# Altium project BMS_2020.PrjPcb (part 2 of 2)

## Sheet TemperatureSensors.SchDoc: Temperature Sensors
size A4; DrawnBy: Jonn Dillon; DocumentNumber: 9; SheetNumber: 9; SheetTotal: 10; Version: 01; Project: Battery Managment System 2020; PageSetup: Record=PageOptions|CenterHorizontal=True|CenterVertical=True|PrintScale=0.97|XCorrection=1.00|YCorrection=1.00|PrintKind=0|BorderSize=5000000|LeftOffset=0|BottomOffset=0|Orientation=2|PaperLength=1000|PaperWidth=1000|Scale=100|PaperSource=7|PrintQuality=-4|MediaType=1|DitherType=10|PaperKind=A4|PrintScaleMode=1
Used 4 times, as channels Temperature Sensor and Connectors/FlexPCBTempSensors1, Temperature Sensor and Connectors/FlexPCBTempSensors2, Temperature Sensor and Connectors/FlexPCBTempSensors3, Temperature Sensor and Connectors/FlexPCBTempSensors4. Parts and nets are listed once, with the designators drawn on the sheet.
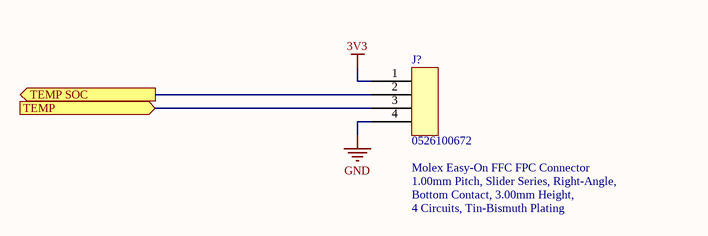
[diagram p8: TemperatureSensors.SchDoc]

### Parts
J?  0526100672  [522710479]

### Ports
TEMP (in), TEMP SOC (out)

### Nets
3V3: J?.1
GND: J?.4
TEMP: J?.3 ; port TEMP
TEMP SOC: J?.2 ; port TEMP SOC

### Channels
Temperature Sensor and Connectors/FlexPCBTempSensors1: designators end in _FlexPCBTempSensors1; ports TEMP SOC=TEMP SOC TEMP=TEMP1
Temperature Sensor and Connectors/FlexPCBTempSensors2: designators end in _FlexPCBTempSensors2; ports TEMP SOC=TEMP SOC TEMP=TEMP2
Temperature Sensor and Connectors/FlexPCBTempSensors3: designators end in _FlexPCBTempSensors3; ports TEMP SOC=TEMP SOC TEMP=TEMP3
Temperature Sensor and Connectors/FlexPCBTempSensors4: designators end in _FlexPCBTempSensors4; ports TEMP SOC=TEMP SOC TEMP=TEMP4

### Notes on the sheet
- (near J?) Molex Easy-On FFC FPC Connector
- 1.00mm Pitch, Slider Series, Right-Angle,
- Bottom Contact, 3.00mm Height,
- 4 Circuits, Tin-Bismuth Plating
- Revision History:
- Sheet Title:
- Rev
- Date
- Description
- Project:
- Size:
- Drawn By:
- A3
- Number:
- Revision:
- Sheet
- Version:
- of
- QUT Motorsport
- O-120, Gardens Point
- 2 George Street
- Brisbane, QLD 4000
- Australia
- Print Date:
- Print Time:
- File Name:

### Library data of the parts
J? = 4PinMOLEX

## Nets that join several sheets
3V3: IsolationBarrier (R?#1.2), CANBUS_3V3_Isolated (C11.1 J4.1 U4.1), MCU (20 pins), PSU_Disconnect (5 pins), TemperatureSensor (P?#3.1), Temperature Sensor and Connectors/FlexPCBTempSensors1 (J?_FlexPCBTempSensors1.1), Temperature Sensor and Connectors/FlexPCBTempSensors2 (J?_FlexPCBTempSensors2.1), Temperature Sensor and Connectors/FlexPCBTempSensors3 (J?_FlexPCBTempSensors3.1), Temperature Sensor and Connectors/FlexPCBTempSensors4 (J?_FlexPCBTempSensors4.1)
36V: CellMonitor (Q?.3 R?#2.1), PSU_Disconnect (C?#9.2 U6.5)
CF0: CANBUS_3V3_Isolated (C11.2 U4.4), MCU (18 pins), CellMonitor (17 pins), Cell Monitor and Front End/CELL 1 INTERFACE (C?_CELL_1_INTERFACE.1), PSU_Disconnect (6 pins), TemperatureSensor (P?#3.4), Temperature Sensor and Connectors/FlexPCBTempSensors1 (J?_FlexPCBTempSensors1.4), Temperature Sensor and Connectors/FlexPCBTempSensors2 (J?_FlexPCBTempSensors2.4), Temperature Sensor and Connectors/FlexPCBTempSensors3 (J?_FlexPCBTempSensors3.4), Temperature Sensor and Connectors/FlexPCBTempSensors4 (J?_FlexPCBTempSensors4.4)
CVF1: CellMonitor (F?#11.2 R?#11.1), Cell Monitor and Front End/CELL 1 INTERFACE (J8_CELL_1_INTERFACE.1 R14_CELL_1_INTERFACE.1), Cell Monitor and Front End/CELL 2 INTERFACE (D?_CELL_2_INTERFACE.1 Q?_CELL_2_INTERFACE.3)
CVF5: CellMonitor (F?#7.2 R?#7.1 R?#10.1), Cell Monitor and Front End/CELL 5 INTERFACE (J8_CELL_5_INTERFACE.1 R14_CELL_5_INTERFACE.1), Cell Monitor and Front End/CELL 6 INTERFACE (D?_CELL_6_INTERFACE.1 Q?_CELL_6_INTERFACE.3)
ISO 3V3: IsolationBarrier (J?#1.5 J?#2.5), CANBUS_3V3_Isolated (5 pins)
ISO GND: IsolationBarrier (5 pins), CANBUS_3V3_Isolated (6 pins)
VC5X: CellMonitor (C?#7.1 D?#3.K R?#6.1), Cell Monitor and Front End/CELL 6 INTERFACE (C?_CELL_6_INTERFACE.1)
BMS BOOT: IsolationBarrier (U3.3), CellMonitor (R?#12.1 S?.1 U?#3.6)
CAN RX: CANBUS_3V3_Isolated (R10.1 TP6.1 U4.3), MCU (U1.32)
CAN TX: CANBUS_3V3_Isolated (R9.1 TP3.1 U4.2), MCU (U1.33)
CVF0: CellMonitor (F?#12.2 R?#13.1 R?#14.1), Cell Monitor and Front End/CELL 1 INTERFACE (D?_CELL_1_INTERFACE.1 Q?_CELL_1_INTERFACE.3)
CVF2: CellMonitor (F?#10.2), Cell Monitor and Front End/CELL 2 INTERFACE (J8_CELL_2_INTERFACE.1 R14_CELL_2_INTERFACE.1)
CVF3: CellMonitor (F?#9.2), Cell Monitor and Front End/CELL 3 INTERFACE (J8_CELL_3_INTERFACE.1 R14_CELL_3_INTERFACE.1), Cell Monitor and Front End/CELL 4 INTERFACE (D?_CELL_4_INTERFACE.1 Q?_CELL_4_INTERFACE.3)
CVF4: CellMonitor (F?#8.2), Cell Monitor and Front End/CELL 4 INTERFACE (J8_CELL_4_INTERFACE.1 R14_CELL_4_INTERFACE.1), Cell Monitor and Front End/CELL 5 INTERFACE (D?_CELL_5_INTERFACE.1 Q?_CELL_5_INTERFACE.3)
CVF6: CellMonitor (F?#6.2), Cell Monitor and Front End/CELL 6 INTERFACE (J8_CELL_6_INTERFACE.1 R14_CELL_6_INTERFACE.1), Cell Monitor and Front End/CELL 7 INTERFACE (D?_CELL_7_INTERFACE.1 Q?_CELL_7_INTERFACE.3)
CVF7: CellMonitor (F?#5.2), Cell Monitor and Front End/CELL 7 INTERFACE (J8_CELL_7_INTERFACE.1 R14_CELL_7_INTERFACE.1), Cell Monitor and Front End/CELL 8 INTERFACE (D?_CELL_8_INTERFACE.1 Q?_CELL_8_INTERFACE.3)
CVF8: CellMonitor (F?#4.2), Cell Monitor and Front End/CELL 8 INTERFACE (J8_CELL_8_INTERFACE.1 R14_CELL_8_INTERFACE.1), Cell Monitor and Front End/CELL 9 INTERFACE (D?_CELL_9_INTERFACE.1 Q?_CELL_9_INTERFACE.3)
CVF9: CellMonitor (F?#3.2), Cell Monitor and Front End/CELL 10 INTERFACE (D?_CELL_10_INTERFACE.1 Q?_CELL_10_INTERFACE.3), Cell Monitor and Front End/CELL 9 INTERFACE (J8_CELL_9_INTERFACE.1 R14_CELL_9_INTERFACE.1)
CVF10: CellMonitor (F?#2.2), Cell Monitor and Front End/CELL 10 INTERFACE (J8_CELL_10_INTERFACE.1 R14_CELL_10_INTERFACE.1)
I2C SCL: MCU (R3.1 U1.42), CellMonitor (U?#3.5)
I2C SDA: MCU (R4.1 U1.43), CellMonitor (U?#3.4)
nALARM: IsolationBarrier (U2.2), MCU (U1.15)
NetC?#7_2: CellMonitor (C?#7.2 R?#10.2 U?#3.21), Cell Monitor and Front End/CELL 6 INTERFACE (R?_CELL_6_INTERFACE.2)
NetC?#8_2: CellMonitor (C?#8.2 R?#13.2 U?#3.27), Cell Monitor and Front End/CELL 1 INTERFACE (R?_CELL_1_INTERFACE.2)
NetC?_CELL_1_INTERFACE_2: CellMonitor (U?#3.26), Cell Monitor and Front End/CELL 1 INTERFACE (C?_CELL_1_INTERFACE.2 R14_CELL_1_INTERFACE.2), Cell Monitor and Front End/CELL 2 INTERFACE (C?_CELL_2_INTERFACE.1 R?_CELL_2_INTERFACE.2)
NetC?_CELL_2_INTERFACE_2: CellMonitor (U?#3.25), Cell Monitor and Front End/CELL 2 INTERFACE (C?_CELL_2_INTERFACE.2 R14_CELL_2_INTERFACE.2), Cell Monitor and Front End/CELL 3 INTERFACE (C?_CELL_3_INTERFACE.1 R?_CELL_3_INTERFACE.2)
NetC?_CELL_3_INTERFACE_2: CellMonitor (U?#3.24), Cell Monitor and Front End/CELL 3 INTERFACE (C?_CELL_3_INTERFACE.2 R14_CELL_3_INTERFACE.2), Cell Monitor and Front End/CELL 4 INTERFACE (C?_CELL_4_INTERFACE.1 R?_CELL_4_INTERFACE.2)
NetC?_CELL_4_INTERFACE_2: CellMonitor (U?#3.23), Cell Monitor and Front End/CELL 4 INTERFACE (C?_CELL_4_INTERFACE.2 R14_CELL_4_INTERFACE.2), Cell Monitor and Front End/CELL 5 INTERFACE (C?_CELL_5_INTERFACE.1 R?_CELL_5_INTERFACE.2)
NetC?_CELL_5_INTERFACE_2: CellMonitor (D?#3.A U?#3.22), Cell Monitor and Front End/CELL 5 INTERFACE (C?_CELL_5_INTERFACE.2 R14_CELL_5_INTERFACE.2)
NetC?_CELL_6_INTERFACE_2: CellMonitor (U?#3.20), Cell Monitor and Front End/CELL 6 INTERFACE (C?_CELL_6_INTERFACE.2 R14_CELL_6_INTERFACE.2), Cell Monitor and Front End/CELL 7 INTERFACE (C?_CELL_7_INTERFACE.1 R?_CELL_7_INTERFACE.2)
NetC?_CELL_7_INTERFACE_2: CellMonitor (U?#3.19), Cell Monitor and Front End/CELL 7 INTERFACE (C?_CELL_7_INTERFACE.2 R14_CELL_7_INTERFACE.2), Cell Monitor and Front End/CELL 8 INTERFACE (C?_CELL_8_INTERFACE.1 R?_CELL_8_INTERFACE.2)
NetC?_CELL_8_INTERFACE_2: CellMonitor (U?#3.18), Cell Monitor and Front End/CELL 8 INTERFACE (C?_CELL_8_INTERFACE.2 R14_CELL_8_INTERFACE.2), Cell Monitor and Front End/CELL 9 INTERFACE (C?_CELL_9_INTERFACE.1 R?_CELL_9_INTERFACE.2)
NetC?_CELL_9_INTERFACE_2: CellMonitor (U?#3.17), Cell Monitor and Front End/CELL 10 INTERFACE (C?_CELL_10_INTERFACE.1 R?_CELL_10_INTERFACE.2), Cell Monitor and Front End/CELL 9 INTERFACE (C?_CELL_9_INTERFACE.2 R14_CELL_9_INTERFACE.2)
NetC?_CELL_10_INTERFACE_2: CellMonitor (D?#1.A U?#3.16), Cell Monitor and Front End/CELL 10 INTERFACE (C?_CELL_10_INTERFACE.2 R14_CELL_10_INTERFACE.2)
NetR?#11_2: IsolationBarrier (U3.4), CellMonitor (R?#11.2 S?.2)
TEMP SOC: MCU (U1.19), TemperatureSensor (P?#3.2), Temperature Sensor and Connectors/FlexPCBTempSensors1 (J?_FlexPCBTempSensors1.2), Temperature Sensor and Connectors/FlexPCBTempSensors2 (J?_FlexPCBTempSensors2.2), Temperature Sensor and Connectors/FlexPCBTempSensors3 (J?_FlexPCBTempSensors3.2), Temperature Sensor and Connectors/FlexPCBTempSensors4 (J?_FlexPCBTempSensors4.2)